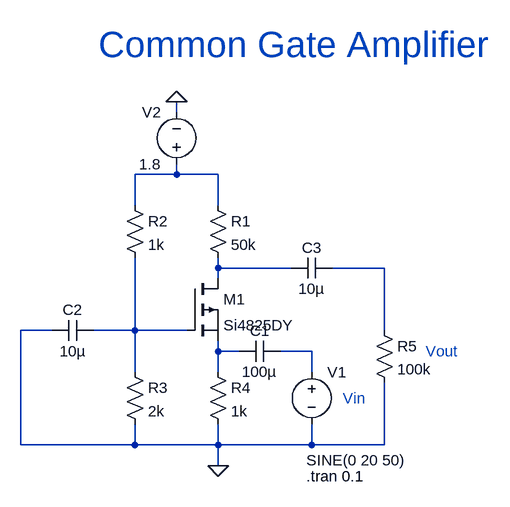
[diagram p0: schematic Common_Gate_amp.asc]
Common_Gate_amp.asc, the LTspice schematic file:
Version 4
SHEET 1 880 680
WIRE 160 -144 160 -160
WIRE 160 -48 160 -64
WIRE 160 -48 96 -48
WIRE 224 -48 160 -48
WIRE 96 0 96 -48
WIRE 224 0 224 -48
WIRE 224 96 224 80
WIRE 336 96 224 96
WIRE 480 96 400 96
WIRE 224 112 224 96
WIRE -32 192 -80 192
WIRE 96 192 96 80
WIRE 96 192 32 192
WIRE 176 192 96 192
WIRE 480 192 480 96
WIRE 224 224 224 208
WIRE 256 224 224 224
WIRE 368 224 320 224
WIRE 96 256 96 192
WIRE 224 256 224 224
WIRE 368 256 368 224
WIRE -80 368 -80 192
WIRE 96 368 96 336
WIRE 96 368 -80 368
WIRE 224 368 224 336
WIRE 224 368 96 368
WIRE 368 368 368 336
WIRE 368 368 224 368
WIRE 480 368 480 272
WIRE 480 368 368 368
WIRE 224 400 224 368
FLAG 224 400 0
FLAG 160 -160 0
SYMBOL res 208 -16 R0
SYMATTR InstName R1
SYMATTR Value 50k
SYMBOL res 80 -16 R0
SYMATTR InstName R2
SYMATTR Value 1k
SYMBOL res 80 240 R0
SYMATTR InstName R3
SYMATTR Value 2k
SYMBOL res 208 240 R0
SYMATTR InstName R4
SYMATTR Value 1k
SYMBOL cap 320 208 R90
WINDOW 0 0 32 VBottom 2
WINDOW 3 32 32 VTop 2
SYMATTR InstName C1
SYMATTR Value 100µ
SYMBOL voltage 368 240 R0
WINDOW 123 0 0 Left 0
WINDOW 39 0 0 Left 0
WINDOW 3 -8 152 Left 2
SYMATTR Value SINE(0 20 50)
SYMATTR InstName V1
SYMBOL voltage 160 -48 R180
WINDOW 0 24 96 Left 2
WINDOW 3 24 16 Left 2
WINDOW 123 0 0 Left 0
WINDOW 39 0 0 Left 0
SYMATTR InstName V2
SYMATTR Value 1.8
SYMBOL pmos 176 112 R0
SYMATTR InstName M1
SYMATTR Value Si4825DY
SYMBOL cap 32 176 R90
WINDOW 0 0 32 VBottom 2
WINDOW 3 32 32 VTop 2
SYMATTR InstName C2
SYMATTR Value 10µ
SYMBOL cap 400 80 R90
WINDOW 0 0 32 VBottom 2
WINDOW 3 32 32 VTop 2
SYMATTR InstName C3
SYMATTR Value 10µ
SYMBOL res 464 176 R0
SYMATTR InstName R5
SYMATTR Value 100k
TEXT 360 416 Left 2 !.tran 0.1
TEXT 40 -248 Left 5 ;Common Gate Amplifier
TEXT 544 224 Left 2 ;Vout
TEXT 416 296 Left 2 ;Vin

The netlist it stands for:
* Common_Gate_amp.asc
R1 N001 N002 50k
R2 N001 N004 1k
R3 N004 0 2k
R4 N005 0 1k
C1 N006 N005 100µ
V1 N006 0 SINE(0 20 50)
V2 N001 0 1.8
M1 N002 N004 N005 N005 Si4825DY
C2 N004 0 10µ
C3 N003 N002 10µ
R5 N003 0 100k
.model NMOS NMOS
.model PMOS PMOS
.lib standard.mos
.tran 0.1
* Common Gate Amplifier
* Vout
* Vin
.backanno
.end